# EAGLE schematic L000-Power-Schematic (EAGLE 7.7.0)
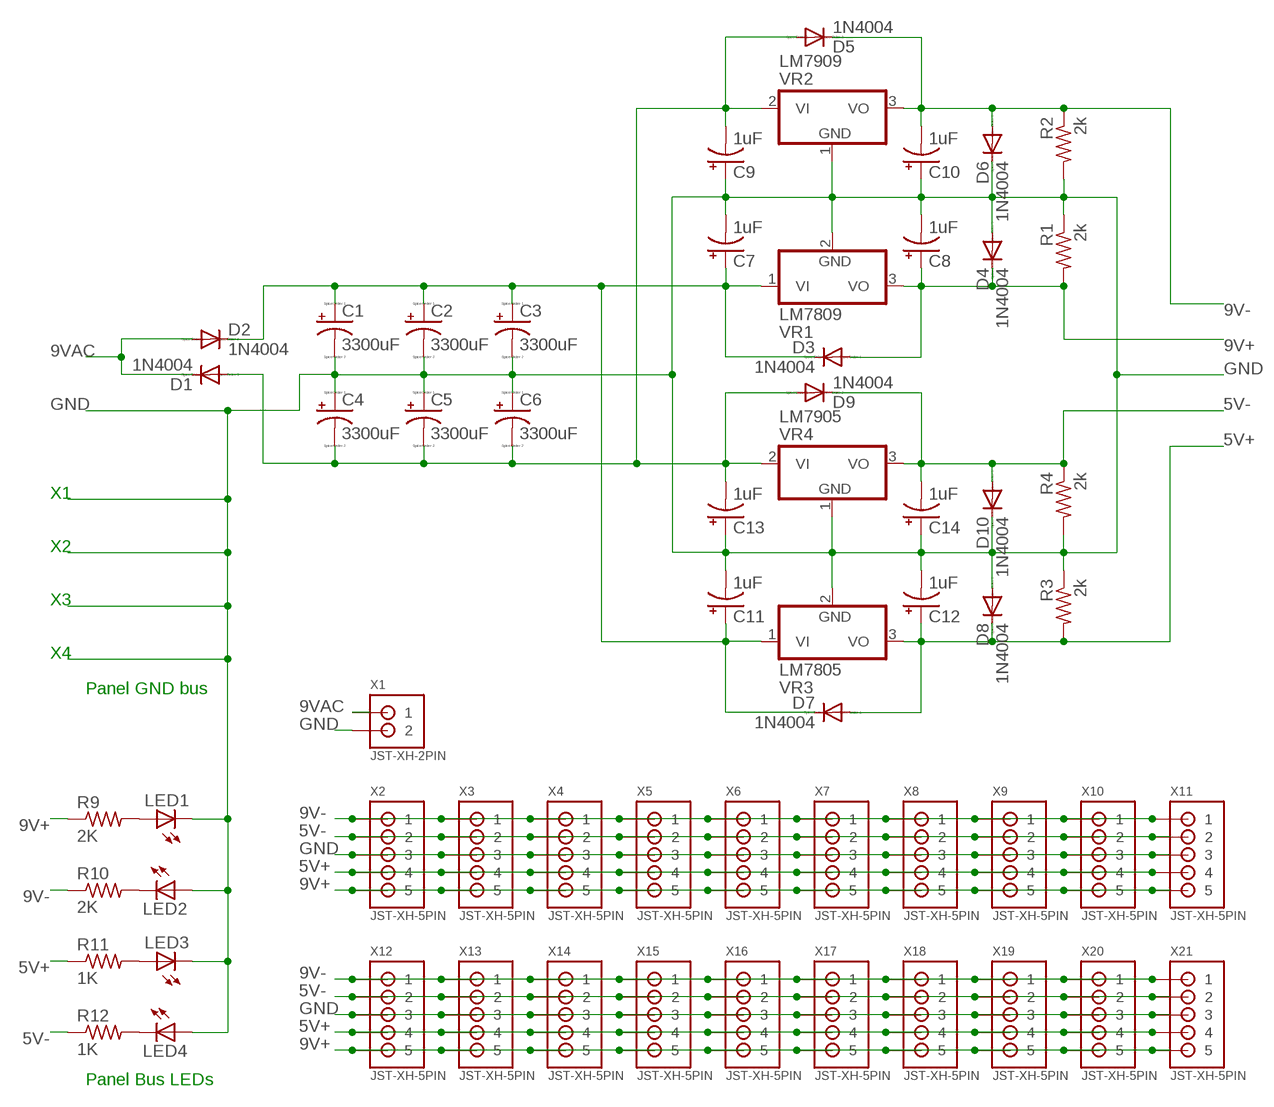
[diagram p0: schematic, sheet 1]

## Parts
C1  3300uF  CPOL-USE5-13  [E5-13]
C2  3300uF  CPOL-USE5-13  [E5-13]
C3  3300uF  CPOL-USE5-13  [E5-13]
C4  3300uF  CPOL-USE5-13  [E5-13]
C5  3300uF  CPOL-USE5-13  [E5-13]
C6  3300uF  CPOL-USE5-13  [E5-13]
C7  1uF  CPOL-USE2,5-6E  [E2,5-6E]
C8  1uF  CPOL-USE2,5-6E  [E2,5-6E]
C9  1uF  CPOL-USE2,5-6E  [E2,5-6E]
C10  1uF  CPOL-USE2,5-6E  [E2,5-6E]
C11  1uF  CPOL-USE2,5-6E  [E2,5-6E]
C12  1uF  CPOL-USE2,5-6E  [E2,5-6E]
C13  1uF  CPOL-USE2,5-6E  [E2,5-6E]
C14  1uF  CPOL-USE2,5-6E  [E2,5-6E]
D1  1N4004  [DO41-10]
D2  1N4004  [DO41-10]
D3  1N4004  [DO41-10]
D4  1N4004  [DO41-10]
D5  1N4004  [DO41-10]
D6  1N4004  [DO41-10]
D7  1N4004  [DO41-10]
D8  1N4004  [DO41-10]
D9  1N4004  [DO41-10]
D10  1N4004  [DO41-10]
LED1  LED5MM  [LED5MM]
LED2  LED5MM  [LED5MM]
LED3  LED5MM  [LED5MM]
LED4  LED5MM  [LED5MM]
R1  2k  R-US_0309/10  [0309/10]
R2  2k  R-US_0309/10  [0309/10]
R3  2k  R-US_0309/10  [0309/10]
R4  2k  R-US_0309/10  [0309/10]
R9  2K  R-US_0309/10  [0309/10]
R10  2K  R-US_0309/10  [0309/10]
R11  1K  R-US_0309/10  [0309/10]
R12  1K  R-US_0309/10  [0309/10]
VR1  LM7809  7808T  [TO220H]
VR2  LM7909  7908T  [TO220H]
VR3  LM7805  7805T  [TO220H]
VR4  LM7905  7905T  [TO220H]
X1  JST-XH-2PIN  JST-PH_2-PIN_HEADER  [JST_B2B-PH_HEADER]
X2  JST-XH-5PIN  JST-PH_5-PIN_HEADER  [JST_B5B-PH_HEADER]
X3  JST-XH-5PIN  JST-PH_5-PIN_HEADER  [JST_B5B-PH_HEADER]
X4  JST-XH-5PIN  JST-PH_5-PIN_HEADER  [JST_B5B-PH_HEADER]
X5  JST-XH-5PIN  JST-PH_5-PIN_HEADER  [JST_B5B-PH_HEADER]
X6  JST-XH-5PIN  JST-PH_5-PIN_HEADER  [JST_B5B-PH_HEADER]
X7  JST-XH-5PIN  JST-PH_5-PIN_HEADER  [JST_B5B-PH_HEADER]
X8  JST-XH-5PIN  JST-PH_5-PIN_HEADER  [JST_B5B-PH_HEADER]
X9  JST-XH-5PIN  JST-PH_5-PIN_HEADER  [JST_B5B-PH_HEADER]
X10  JST-XH-5PIN  JST-PH_5-PIN_HEADER  [JST_B5B-PH_HEADER]
X11  JST-XH-5PIN  JST-PH_5-PIN_HEADER  [JST_B5B-PH_HEADER]
X12  JST-XH-5PIN  JST-PH_5-PIN_HEADER  [JST_B5B-PH_HEADER]
X13  JST-XH-5PIN  JST-PH_5-PIN_HEADER  [JST_B5B-PH_HEADER]
X14  JST-XH-5PIN  JST-PH_5-PIN_HEADER  [JST_B5B-PH_HEADER]
X15  JST-XH-5PIN  JST-PH_5-PIN_HEADER  [JST_B5B-PH_HEADER]
X16  JST-XH-5PIN  JST-PH_5-PIN_HEADER  [JST_B5B-PH_HEADER]
X17  JST-XH-5PIN  JST-PH_5-PIN_HEADER  [JST_B5B-PH_HEADER]
X18  JST-XH-5PIN  JST-PH_5-PIN_HEADER  [JST_B5B-PH_HEADER]
X19  JST-XH-5PIN  JST-PH_5-PIN_HEADER  [JST_B5B-PH_HEADER]
X20  JST-XH-5PIN  JST-PH_5-PIN_HEADER  [JST_B5B-PH_HEADER]
X21  JST-XH-5PIN  JST-PH_5-PIN_HEADER  [JST_B5B-PH_HEADER]

## Nets
5V+: C12.+ D7.A D8.C R3.2 R11.1 VR3.3(VO) X2.P4 X3.P4 X4.P4 X5.P4 X6.P4 X7.P4 X8.P4 X9.P4 X10.P4 X11.P4 X12.P4 X13.P4 X14.P4 X15.P4 X16.P4 X17.P4 X18.P4 X19.P4 X20.P4 X21.P4
5V-: C14.- D9.C D10.A R4.1 R12.1 VR4.3(VO) X2.P2 X3.P2 X4.P2 X5.P2 X6.P2 X7.P2 X8.P2 X9.P2 X10.P2 X11.P2 X12.P2 X13.P2 X14.P2 X15.P2 X16.P2 X17.P2 X18.P2 X19.P2 X20.P2 X21.P2
9V+: C8.+ D3.A D4.C R1.2 R9.1 VR1.3(VO) X2.P5 X3.P5 X4.P5 X5.P5 X6.P5 X7.P5 X8.P5 X9.P5 X10.P5 X11.P5 X12.P5 X13.P5 X14.P5 X15.P5 X16.P5 X17.P5 X18.P5 X19.P5 X20.P5 X21.P5
9V-: C10.- D5.C D6.A R2.1 R10.1 VR2.3(VO) X2.P1 X3.P1 X4.P1 X5.P1 X6.P1 X7.P1 X8.P1 X9.P1 X10.P1 X11.P1 X12.P1 X13.P1 X14.P1 X15.P1 X16.P1 X17.P1 X18.P1 X19.P1 X20.P1 X21.P1
9VAC: D1.C D2.A X1.P1
GND: C1.- C2.- C3.- C4.+ C5.+ C6.+ C7.- C8.- C9.+ C10.+ C11.- C12.- C13.+ C14.+ D4.A D6.C D8.A D10.C LED1.K(C) LED2.A LED3.K(C) LED4.A R1.1 R2.2 R3.1 R4.2 VR1.2(GND) VR2.1(GND) VR3.2(GND) VR4.1(GND) X1.P2 X2.P3 X3.P3 X4.P3 X5.P3 X6.P3 X7.P3 X8.P3 X9.P3 X10.P3 X11.P3 X12.P3 X13.P3 X14.P3 X15.P3 X16.P3 X17.P3 X18.P3 X19.P3 X20.P3 X21.P3
N$2: LED3.A R11.2
N$3: LED4.K(C) R12.2
N$4: LED1.A R9.2
N$5: LED2.K(C) R10.2
N$7: C1.+ C2.+ C3.+ C7.+ C11.+ D2.C D3.C D7.C VR1.1(VI) VR3.1(VI)
N$14: C4.- C5.- C6.- C9.- C13.- D1.A D5.A D9.A VR2.2(VI) VR4.2(VI)

## Notes on the sheet
- X1
- X2
- X3
- X4
- Panel GND bus
- Panel Bus LEDs

## Library data of the parts
C1-C6 = resistor:CPOL-US: POLARIZED CAPACITOR, American symbol
C7-C14 = rcl:CPOL-US: POLARIZED CAPACITOR, American symbol
D1-D10 = diode:1N4004: DIODE general purpose rectifier, 1 A
LED1-LED4 = led:LED: LED OSRAM: - CHIPLED LG R971, LG N971, LY N971, LG Q971, LY Q971, LO R971, LY R971 LH N974, LH R974 LS Q976, LO Q976, LY Q976 LO Q996 - Hyper CHIPLED LW Q18S LB Q993, LB Q99A, LB R99A - SideLED LS A670, LO A670, LY A670, LG A670, LP A670 LB A673, LV A673, LT A673, LW A673 LH A674 LY A675 LS A676, LA A676, LO A676, LY A676, LW A676 LS A679, LY A679, LG A679 - Hyper Micro SIDELED® LS Y876, LA Y876, LO Y876, LY Y876 LT Y87S - SmartLED LW L88C, LW L88S LB L89C, LB L89S, LG L890 LS L89K, LO L89K, LY L89K LS L896, LA L896, LO L896, LY L896 - TOPLED LS T670, LO T670, LY T670, LG T670, LP T670 LSG T670, LSP T670, LSY T670, LOP T670, LYG T670 LG T671, LOG T671, LSG T671 LB T673, LV T673, LT T673, LW T673 LH T674 LS T676, LA T676, LO T676, LY T676, LB T676, LH T676, LSB T676, LW T676 LB T67C, LV T67C, LT T67C, LS T67K, LO T67K, LY T67K, LW E67C LS E67B, LA E67B, LO E67B, LY E67B, LB E67C, LV E67C, LT E67C LW T67C LS T679, LY T679, LG T679 LS T770, LO T770, LY T770, LG T770, LP T770 LB T773, LV T773, LT T773, LW T773 LH T774 LS E675, LA E675, LY E675, LS T675 LS T776, LA T776, LO T776, LY T776, LB T776 LHGB T686 LT T68C, LB T68C - Hyper Mini TOPLED® LB M676 - Mini TOPLED Santana® LG M470 LS M47K, LO M47K, LY M47K Source: http://www.osram.convergy.de LUXEON: - LUMILED® LXK2-PW12-R00, LXK2-PW12-S00, LXK2-PW14-U00, LXK2-PW14-V00 LXK2-PM12-R00, LXK2-PM12-S00, LXK2-PM14-U00 LXK2-PE12-Q00, LXK2-PE12-R00, LXK2-PE12-S00, LXK2-PE14-T00, LXK2-PE14-U00 LXK2-PB12-K00, LXK2-PB12-L00, LXK2-PB12-M00, LXK2-PB14-N00, LXK2-PB14-P00, LXK2-PB14-Q00 LXK2-PR12-L00, LXK2-PR12-M00, LXK2-PR14-Q00, LXK2-PR14-R00 LXK2-PD12-Q00, LXK2-PD12-R00, LXK2-PD12-S00 LXK2-PH12-R00, LXK2-PH12-S00 LXK2-PL12-P00, LXK2-PL12-Q00, LXK2-PL12-R00 Source: www.luxeon.com KINGBRIGHT: KA-3528ASYC Source: www.kingbright.com
R1-R4 R9-R12 = resistor:R-US_: RESISTOR, American symbol
VR1 VR3 = linear:78*: Positive VOLTAGE REGULATOR Source: http://cache.national.com/ds/LM/LM78L05.pdf http://www.fairchildsemi.com/ds/LM/LM7805.pdf
VR2 VR4 = linear:79*: Negative VOLTAGE REGULATOR
X1 = SRG:JST-PH_2-PIN_HEADER: 2-pin JST PH Shrouded Header, top entry P/N B2B-PH-K-S Mating connector PHR-2 Mating cable assembly: Sparkfun PRT-09914 <http://www.sparkfun.com/products/9914>
X2-X21 = SRG:JST-PH_5-PIN_HEADER: 5-pin JST PH Shrouded Header, top entry P/N B5B-PH-K-S Mating connector PHR-5 Mating cable assembly: Sparkfun PRT-09917 <http://www.sparkfun.com/products/9917>